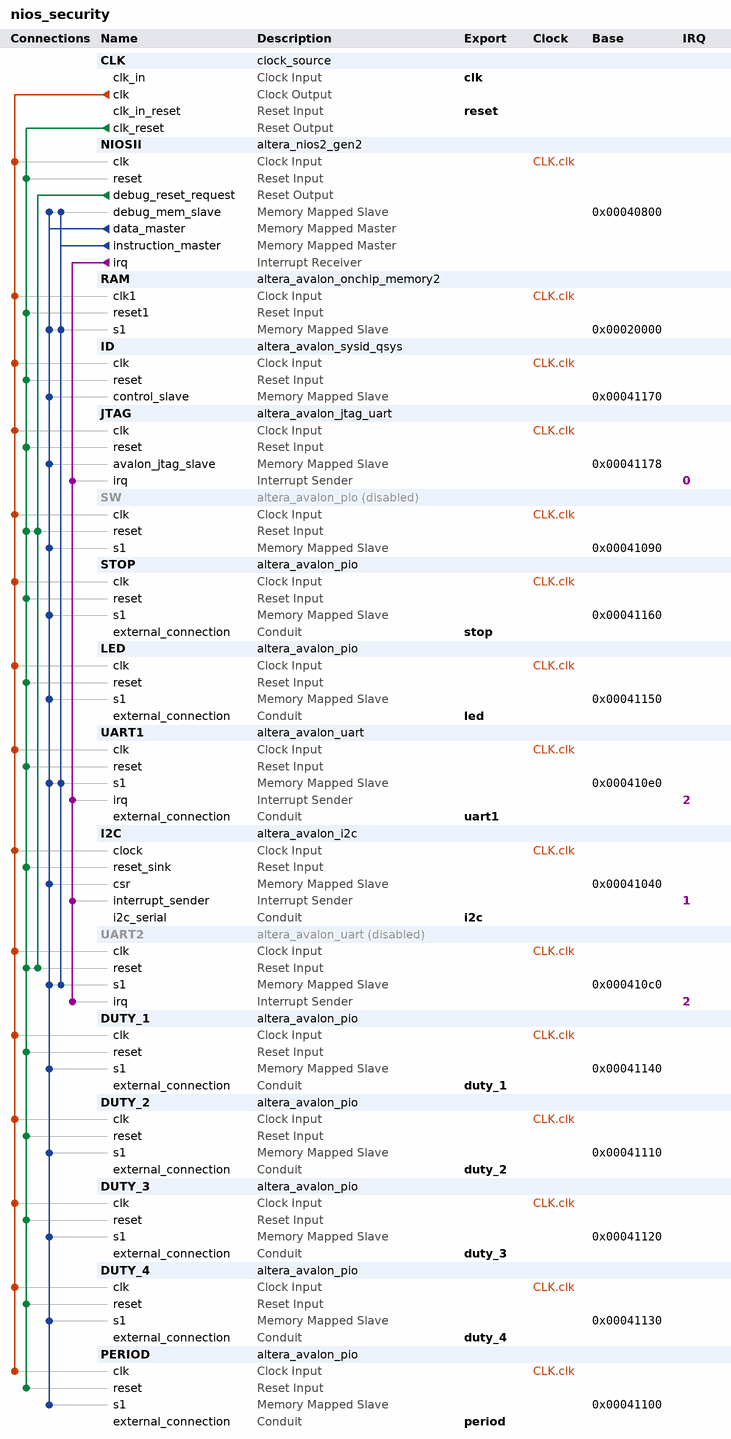
[diagram p0: system contents]
# Platform Designer (Qsys) system nios_security, MAX 10 10M50DAF484C7G
# Parameters at their usual value, and those the tool derives, are not listed.
package require -exact qsys 18.1
create_system nios_security
set_project_property DEVICE_FAMILY {MAX 10}
set_project_property DEVICE 10M50DAF484C7G

add_instance CLK clock_source 18.1
set_instance_parameter_value CLK clockFrequency 50000000

add_instance NIOSII altera_nios2_gen2 18.1
set_instance_parameter_value NIOSII dcache_size 2048
set_instance_parameter_value NIOSII exceptionSlave RAM.s1
set_instance_parameter_value NIOSII icache_size 4096
set_instance_parameter_value NIOSII impl Tiny
set_instance_parameter_value NIOSII resetSlave RAM.s1

add_instance RAM altera_avalon_onchip_memory2 18.1
set_instance_parameter_value RAM dataWidth 32
set_instance_parameter_value RAM dualPort false
set_instance_parameter_value RAM initMemContent false
set_instance_parameter_value RAM initializationFileName onchip_mem.hex
set_instance_parameter_value RAM memorySize 131072

add_instance ID altera_avalon_sysid_qsys 18.1
set_instance_parameter_value ID id 0

add_instance JTAG altera_avalon_jtag_uart 18.1
set_instance_parameter_value JTAG simInteractiveOptions NO_INTERACTIVE_WINDOWS

add_instance SW altera_avalon_pio 18.1
set_instance_property SW ENABLED false
set_instance_parameter_value SW direction Input
set_instance_parameter_value SW width 16

add_instance STOP altera_avalon_pio 18.1
set_instance_parameter_value STOP direction Output
set_instance_parameter_value STOP width 32

add_instance LED altera_avalon_pio 18.1
set_instance_parameter_value LED direction Output
set_instance_parameter_value LED width 32

add_instance UART1 altera_avalon_uart 18.1
set_instance_parameter_value UART1 baud 115200
set_instance_parameter_value UART1 dataBits 8
set_instance_parameter_value UART1 fixedBaud false
set_instance_parameter_value UART1 parity EVEN
set_instance_parameter_value UART1 stopBits 2

add_instance I2C altera_avalon_i2c 18.1
set_instance_parameter_value I2C FIFO_DEPTH 4

add_instance UART2 altera_avalon_uart 18.1
set_instance_property UART2 ENABLED false
set_instance_parameter_value UART2 baud 115200
set_instance_parameter_value UART2 dataBits 8
set_instance_parameter_value UART2 fixedBaud true
set_instance_parameter_value UART2 parity NONE
set_instance_parameter_value UART2 stopBits 1

add_instance DUTY_1 altera_avalon_pio 18.1
set_instance_parameter_value DUTY_1 direction Output
set_instance_parameter_value DUTY_1 width 32

add_instance DUTY_2 altera_avalon_pio 18.1
set_instance_parameter_value DUTY_2 direction Output
set_instance_parameter_value DUTY_2 width 32

add_instance DUTY_3 altera_avalon_pio 18.1
set_instance_parameter_value DUTY_3 direction Output
set_instance_parameter_value DUTY_3 width 32

add_instance DUTY_4 altera_avalon_pio 18.1
set_instance_parameter_value DUTY_4 direction Output
set_instance_parameter_value DUTY_4 width 32

add_instance PERIOD altera_avalon_pio 18.1
set_instance_parameter_value PERIOD direction Output
set_instance_parameter_value PERIOD width 32

# connections
add_connection CLK.clk DUTY_1.clk clock
add_connection CLK.clk DUTY_2.clk clock
add_connection CLK.clk DUTY_3.clk clock
add_connection CLK.clk DUTY_4.clk clock
add_connection CLK.clk I2C.clock clock
add_connection CLK.clk ID.clk clock
add_connection CLK.clk JTAG.clk clock
add_connection CLK.clk LED.clk clock
add_connection CLK.clk NIOSII.clk clock
add_connection CLK.clk PERIOD.clk clock
add_connection CLK.clk RAM.clk1 clock
add_connection CLK.clk STOP.clk clock
add_connection CLK.clk SW.clk clock
add_connection CLK.clk UART1.clk clock
add_connection CLK.clk UART2.clk clock
add_connection CLK.clk_reset DUTY_1.reset reset
add_connection CLK.clk_reset DUTY_2.reset reset
add_connection CLK.clk_reset DUTY_3.reset reset
add_connection CLK.clk_reset DUTY_4.reset reset
add_connection CLK.clk_reset I2C.reset_sink reset
add_connection CLK.clk_reset ID.reset reset
add_connection CLK.clk_reset JTAG.reset reset
add_connection CLK.clk_reset LED.reset reset
add_connection CLK.clk_reset NIOSII.reset reset
add_connection CLK.clk_reset PERIOD.reset reset
add_connection CLK.clk_reset RAM.reset1 reset
add_connection CLK.clk_reset STOP.reset reset
add_connection CLK.clk_reset SW.reset reset
add_connection CLK.clk_reset UART1.reset reset
add_connection CLK.clk_reset UART2.reset reset
add_connection NIOSII.debug_reset_request SW.reset reset
add_connection NIOSII.debug_reset_request UART2.reset reset
add_connection NIOSII.data_master DUTY_1.s1 avalon
set_connection_parameter_value NIOSII.data_master/DUTY_1.s1 baseAddress 0x00041140
add_connection NIOSII.data_master DUTY_2.s1 avalon
set_connection_parameter_value NIOSII.data_master/DUTY_2.s1 baseAddress 0x00041110
add_connection NIOSII.data_master DUTY_3.s1 avalon
set_connection_parameter_value NIOSII.data_master/DUTY_3.s1 baseAddress 0x00041120
add_connection NIOSII.data_master DUTY_4.s1 avalon
set_connection_parameter_value NIOSII.data_master/DUTY_4.s1 baseAddress 0x00041130
add_connection NIOSII.data_master I2C.csr avalon
set_connection_parameter_value NIOSII.data_master/I2C.csr baseAddress 0x00041040
add_connection NIOSII.data_master ID.control_slave avalon
set_connection_parameter_value NIOSII.data_master/ID.control_slave baseAddress 0x00041170
add_connection NIOSII.data_master JTAG.avalon_jtag_slave avalon
set_connection_parameter_value NIOSII.data_master/JTAG.avalon_jtag_slave baseAddress 0x00041178
add_connection NIOSII.data_master LED.s1 avalon
set_connection_parameter_value NIOSII.data_master/LED.s1 baseAddress 0x00041150
add_connection NIOSII.data_master NIOSII.debug_mem_slave avalon
set_connection_parameter_value NIOSII.data_master/NIOSII.debug_mem_slave baseAddress 0x00040800
add_connection NIOSII.data_master PERIOD.s1 avalon
set_connection_parameter_value NIOSII.data_master/PERIOD.s1 baseAddress 0x00041100
add_connection NIOSII.data_master RAM.s1 avalon
set_connection_parameter_value NIOSII.data_master/RAM.s1 baseAddress 0x00020000
add_connection NIOSII.data_master STOP.s1 avalon
set_connection_parameter_value NIOSII.data_master/STOP.s1 baseAddress 0x00041160
add_connection NIOSII.data_master SW.s1 avalon
set_connection_parameter_value NIOSII.data_master/SW.s1 baseAddress 0x00041090
add_connection NIOSII.data_master UART1.s1 avalon
set_connection_parameter_value NIOSII.data_master/UART1.s1 baseAddress 0x000410e0
add_connection NIOSII.data_master UART2.s1 avalon
set_connection_parameter_value NIOSII.data_master/UART2.s1 baseAddress 0x000410c0
add_connection NIOSII.instruction_master NIOSII.debug_mem_slave avalon
set_connection_parameter_value NIOSII.instruction_master/NIOSII.debug_mem_slave baseAddress 0x00040800
add_connection NIOSII.instruction_master RAM.s1 avalon
set_connection_parameter_value NIOSII.instruction_master/RAM.s1 baseAddress 0x00020000
add_connection NIOSII.instruction_master UART1.s1 avalon
set_connection_parameter_value NIOSII.instruction_master/UART1.s1 baseAddress 0x000410e0
add_connection NIOSII.instruction_master UART2.s1 avalon
set_connection_parameter_value NIOSII.instruction_master/UART2.s1 baseAddress 0x000410c0
add_connection NIOSII.irq I2C.interrupt_sender interrupt
set_connection_parameter_value NIOSII.irq/I2C.interrupt_sender irqNumber 1
add_connection NIOSII.irq JTAG.irq interrupt
set_connection_parameter_value NIOSII.irq/JTAG.irq irqNumber 0
add_connection NIOSII.irq UART1.irq interrupt
set_connection_parameter_value NIOSII.irq/UART1.irq irqNumber 2
add_connection NIOSII.irq UART2.irq interrupt
set_connection_parameter_value NIOSII.irq/UART2.irq irqNumber 2

# exported interfaces
add_interface clk clock sink
set_interface_property clk EXPORT_OF CLK.clk_in
add_interface duty_1 conduit end
set_interface_property duty_1 EXPORT_OF DUTY_1.external_connection
add_interface duty_2 conduit end
set_interface_property duty_2 EXPORT_OF DUTY_2.external_connection
add_interface duty_3 conduit end
set_interface_property duty_3 EXPORT_OF DUTY_3.external_connection
add_interface duty_4 conduit end
set_interface_property duty_4 EXPORT_OF DUTY_4.external_connection
add_interface i2c conduit end
set_interface_property i2c EXPORT_OF I2C.i2c_serial
add_interface led conduit end
set_interface_property led EXPORT_OF LED.external_connection
add_interface period conduit end
set_interface_property period EXPORT_OF PERIOD.external_connection
add_interface reset reset sink
set_interface_property reset EXPORT_OF CLK.clk_in_reset
add_interface stop conduit end
set_interface_property stop EXPORT_OF STOP.external_connection
add_interface uart1 conduit end
set_interface_property uart1 EXPORT_OF UART1.external_connection

set_interconnect_requirement {$system} qsys_mm.clockCrossingAdapter HANDSHAKE
set_interconnect_requirement {$system} qsys_mm.enableEccProtection FALSE
set_interconnect_requirement {$system} qsys_mm.insertDefaultSlave FALSE
set_interconnect_requirement {$system} qsys_mm.maxAdditionalLatency 1

save_system nios_security.qsys
